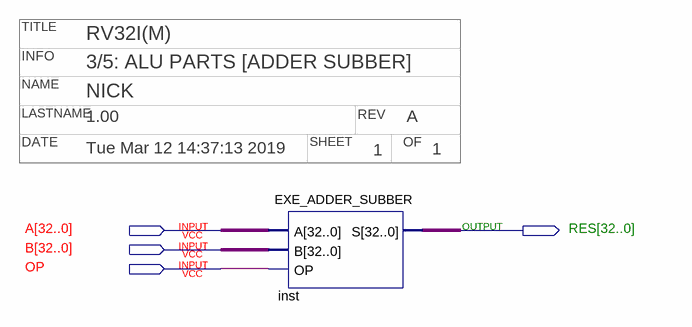
[diagram p0: schematic sheet]
// Quartus schematic EXE_ADDER_SUBBERTEST.bdf as structural Verilog: 1 symbols, 4 pins
// Title block: TITLE: RV32I(M); INFO: 3/5: ALU PARTS [ADDER SUBBER]; NAME: NICK; LASTNAME: 1.00; REV: A; DATE: Tue Mar 12 14:37:13 2019; SHEET: 1; OF: 1
module EXE_ADDER_SUBBERTEST (
  input  [32:0] A,
  input  [32:0] B,
  input  OP,
  output [32:0] RES
);

  EXE_ADDER_SUBBER inst (.A(A), .B(B), .OP(OP), .S(RES));
endmodule
